# Altium schematic sheet IO_Connector.SchDoc
size A4
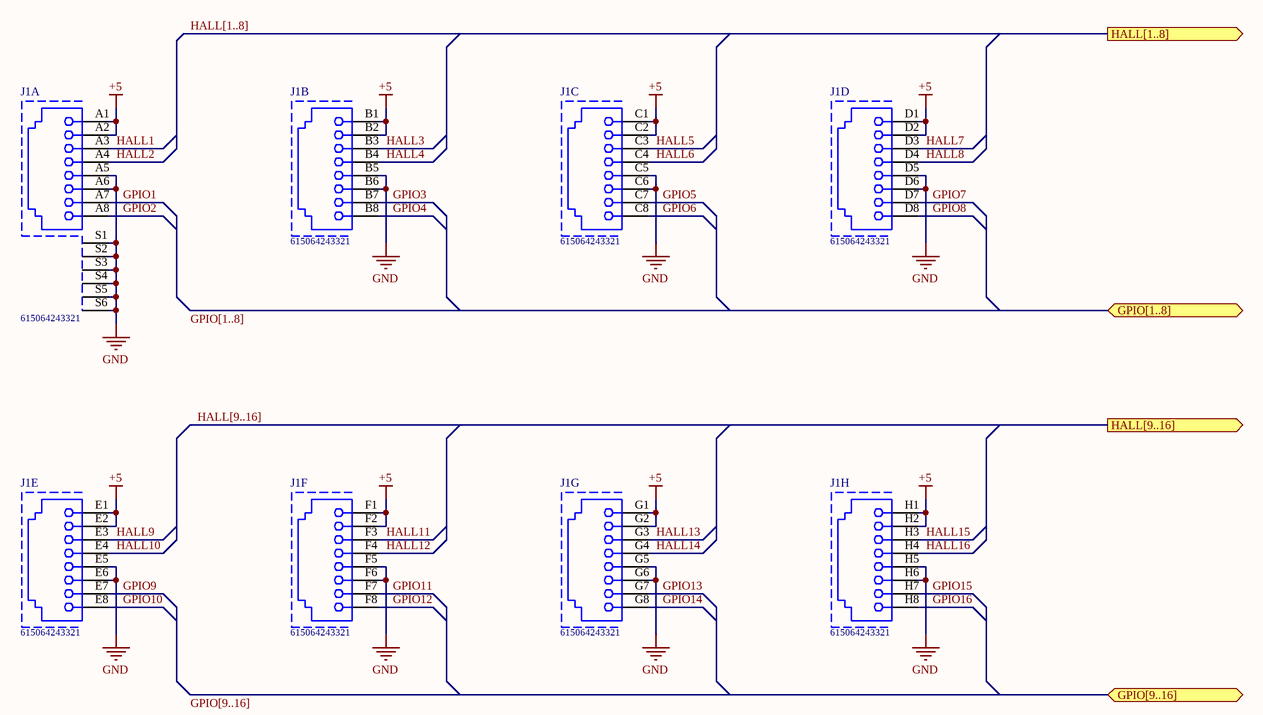
[diagram p0: IO_Connector.SchDoc]

## Parts
J1  615064243321  [615064243321]  (parts A,B,C,D,E,F,G,H of 8)

## Ports
GPIO[1..8] (bidir), GPIO[9..16] (bidir), HALL[1..8] (out), HALL[9..16] (out)

## Nets
+5: J1.A1 J1.A2 J1.B1 J1.B2 J1.C1 J1.C2 J1.D1 J1.D2 J1.E1 J1.E2 J1.F1 J1.F2 J1.G1 J1.G2 J1.H1 J1.H2
GND: J1.A5 J1.A6 J1.B5 J1.B6 J1.C5 J1.C6 J1.D5 J1.D6 J1.E5 J1.E6 J1.F5 J1.F6 J1.G5 J1.G6 J1.H5 J1.H6 J1.S1 J1.S2 J1.S3 J1.S4 J1.S5 J1.S6
GPIO1: J1.A7
GPIO2: J1.A8
GPIO3: J1.B7
GPIO4: J1.B8
GPIO5: J1.C7
GPIO6: J1.C8
GPIO7: J1.D7
GPIO8: J1.D8
GPIO9: J1.E7
GPIO10: J1.E8
GPIO11: J1.F7
GPIO12: J1.F8
GPIO13: J1.G7
GPIO14: J1.G8
GPIO15: J1.H7
GPIO16: J1.H8
HALL1: J1.A3
HALL2: J1.A4
HALL3: J1.B3
HALL4: J1.B4
HALL5: J1.C3
HALL6: J1.C4
HALL7: J1.D3
HALL8: J1.D4
HALL9: J1.E3
HALL10: J1.E4
HALL11: J1.F3
HALL12: J1.F4
HALL13: J1.G3
HALL14: J1.G4
HALL15: J1.H3
HALL16: J1.H4

## Buses and harness runs
bus GPIO[1..8] = port GPIO[1..8]
bus GPIO[9..16] = port GPIO[9..16]
bus HALL[1..8] = port HALL[1..8]
bus HALL[9..16] = port HALL[9..16]

## Library data of the parts
J1 = CMP-1502-01714-1: Modular Jack WR-MJ, Tab Up & Down, Shielded, 2 x 4 Stacked with EMI Panel Finger, Horizontal Entry, THT, 8P8C; Manufacturer: Wurth Elektronik; Working Voltage: 120VAC; Withstanding Voltage: 1000VAC; Port: 2x4; Compliance: Leadfree/RoHS; Contact Resistance: 20mOhm; Rated Current: 1.5A; Mounting Technology: THT; Part Number: 615064243321; Publisher: WurthElektronik; Package Reference: 615064243321; Packaging: Tray; Manufacturer URL: http://www.we-online.de; Operating Temperature: -40to85degC; Entrance: Horizontal; Datasheet URL: https://katalog.we-online.de/em/datasheet/615064243321.pdf; Pin Number: 8P8C